# Altium schematic sheet usb.SchDoc: Micro USB Host/Device Port
size A4; SheetNumber: 12; SheetTotal: 18
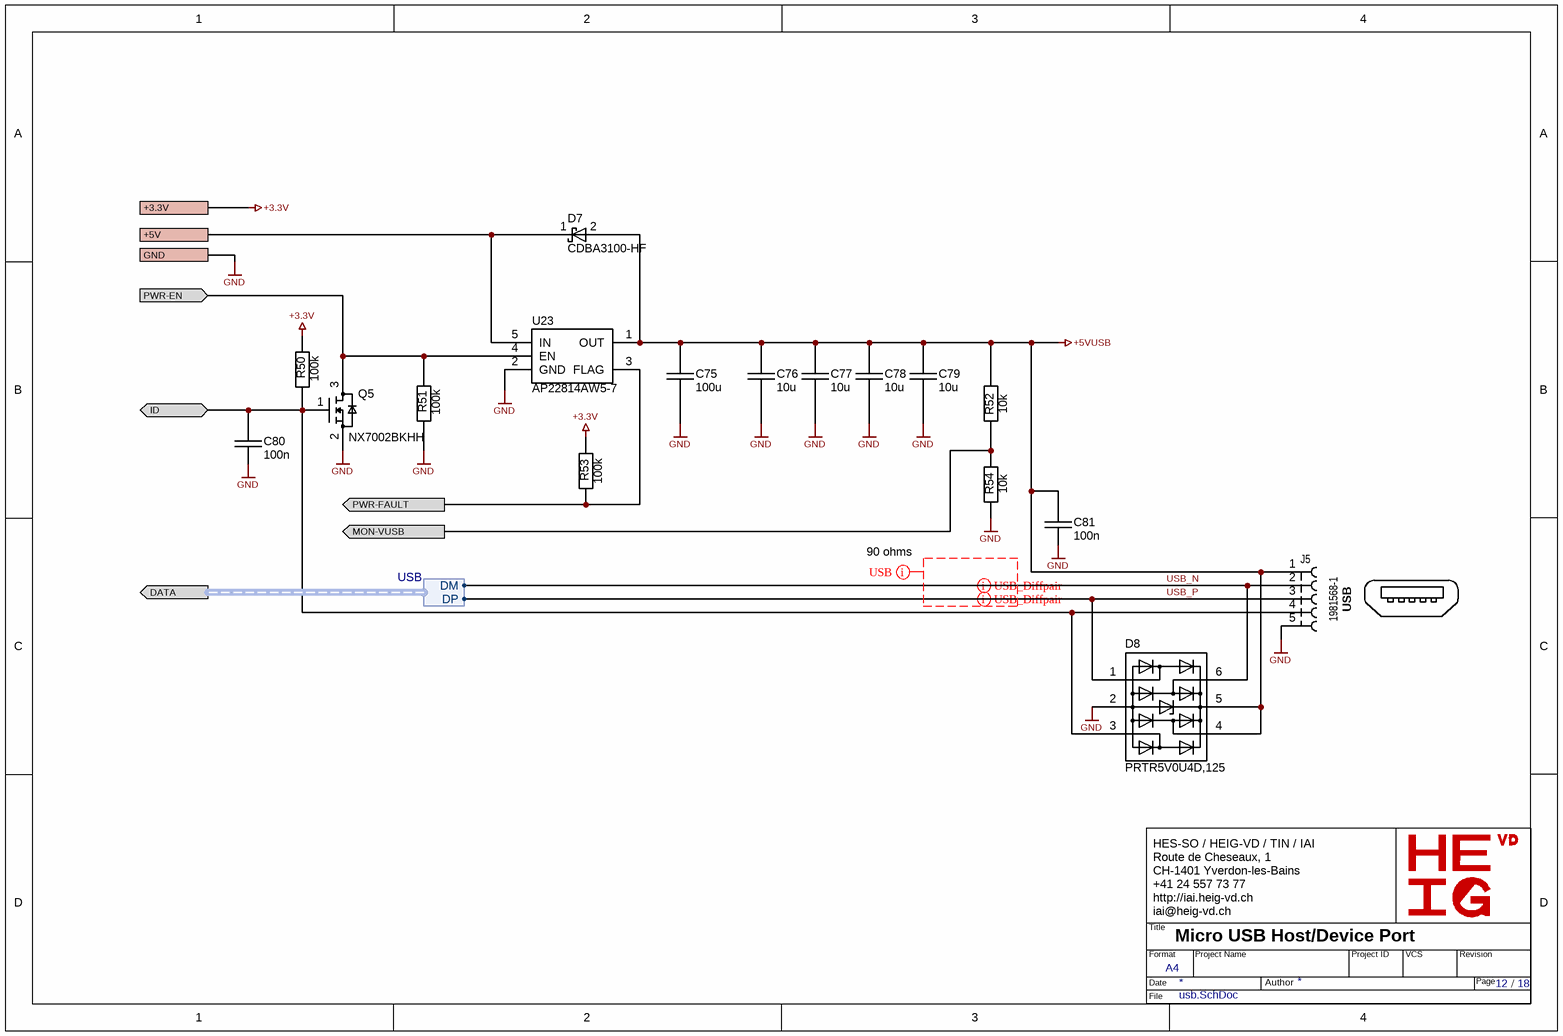
[diagram p0: usb.SchDoc]

## Parts
C75  100u  [SM/C1210]
C76  10u  [SM/C0603]
C77  10u  [SM/C0603]
C78  10u  [SM/C0603]
C79  10u  [SM/C0603]
C80  100n  [SM/C0402]
C81  100n  [SM/C0402]
D7  CDBA3100-HF  [DO214AC]
D8  PRTR5V0U4D,125  [SOT23-6]
J5  1981568-1  Function: USB  [TE/1981568-1/USB]
Q5  NX7002BKHH  [SOT8001/DFN0606-3]
R50  100k  [SM/R0805]
R51  100k  [SM/R0805]
R52  10k  [SM/R0402]
R53  100k  [SM/R0805]
R54  10k  [SM/R0402]
U23  AP22814AW5-7  [SOT23-5]

## Ports
+3.3V, +5V, DATA (out, harness USB), GND, ID (bidir), MON-VUSB (out), PWR-EN (in), PWR-FAULT (out)

## Harnesses
USB: DP, DM

## Nets
+3.3V: R50.2 R53.2 ; port +3.3V
+5VUSB: C75.1 C76.1 C77.1 C78.1 C79.1 C81.1 D7.2(A) D8.4(ESD3) D8.5(GND) J5.1 R52.2 U23.1(OUT)
GND: C75.2 C76.2 C77.2 C78.2 C79.2 C80.2 C81.2 D8.2(VCC) J5.5 Q5.2(VCC) R51.1 R54.1 U23.2(GND) ; port GND
+5V: D7.1(K) U23.5(IN) ; port +5V
ID: C80.1 D8.3(ESD2) J5.4 Q5.1(VCC) R50.1 ; port ID
MON-VUSB: R52.1 R54.2 ; port MON-VUSB
PWR-EN: Q5.3(VCC) R51.2 U23.4(EN) ; port PWR-EN
PWR-FAULT: R53.1 U23.3(FLAG) ; port PWR-FAULT
USB_N: D8.6(ESD4) J5.2 ; port DATA.DM
USB_P: D8.1(ESD1) J5.3 ; port DATA.DP

## Layout directives
differential pair: USB_N, USB_P
rule Impedance Constraint [Min = 85.00    Max = 95.00    ]; Impedance: 90 ohms; rule Differential Pairs Routing [Pref Gap = 6.43mil    Min Gap  = 5.906mil    Max Gap  = 6.43milPref Width = 9.048mil    Min Width  = 5.906mil    Max Width  = 9.048mil]; rule Matched Net Lengths [Tolerance = 10mil]; net class USB: (no net found under the mark)

## Notes on the sheet
- HES-SO / HEIG-VD / TIN / IAI
  Route de Cheseaux, 1
  CH-1401 Yverdon-les-Bains
  +41 24 557 73 77
  http://iai.heig-vd.ch
  iai@heig-vd.ch
- Title
- Format
- Date
- A4
- Project Name
- Author
- Project ID
- VCS
- Revision
- Page
- /
- File

## Library data of the parts
C75 = CAP CER 100UF 10V X5R 1210: 100 µF ±20% 10V Ceramic Capacitor X5R 1210 (3225 Metric); Supplier 1: Digi-Key; Supplier Part Number 1: 1276-3364-1-ND; Value: 100u; Voltage: 10V; Dielectric: X5R
C76-C79 = CAP CER 10UF 25V X5R 0603: 10 µF ±20% 25V Ceramic Capacitor X5R 0603 (1608 Metric); Dielectric: X7R; Supplier 1: Digi-Key; Supplier Part Number 1: 490-7202-1-ND; Voltage: 25V; Value: 10u
C80 C81 = CAP CER 100NF 25V X5R 0402: 100 nF ±10% 25V Ceramic Capacitor X5R 0402 (1005 Metric); Voltage: 25V; Dielectric: X5R; Supplier 1: Digi-Key; Supplier Part Number 1: 1276-1043-1-ND; Value: 100n
D7 = DIODE SCHOTTKY 100V 3A DO214AC: Diode 100 V 3A Surface Mount DO-214AC (SMA); Supplier 1: Digi-Key; Supplier Part Number 1: 641-1747-1-ND
D8 = PRTR5V0U4D: Ultra low capacitance quadruple rail-to-rail ESD protection, surface mount 6-TSOP; Mounting: SMD; Supplier 1: Digi-Key; Supplier Part Number 1: 1727-3890-1-ND; Supplier 2: Mouser; Supplier Part Number 2: 771-PRTR5V0U4D-T/R
J5 = CONN 5 Socket: USB - micro B USB 2.0 Receptacle Connector 5 Position Surface Mount, Right Angle; Supplier 1: Digi-Key; Supplier Part Number 1: A97800CT-ND
Q5 = 2N7002: N-Channel 60 V 350mA (Ta) 380mW (Ta), 2.8W (Tc) Surface Mount DFN0606-3; Value: 2N7002; Supplier 1: Digi-Key; Supplier Part Number 1: 1727-8574-1-ND
R50 R51 R53 = RES 100K OHM 1% 1/16W 0402: 100 kOhms ±1% 0.063W, 1/16W Chip Resistor 0402 (1005 Metric) Moisture Resistant Thick Film; Supplier 1: Digi-Key; Supplier Part Number 1: 13-RC0402FR-13100KLCT-ND; Value: 100k
R52 R54 = RES 10K OHM 1% 1/16W 0402: 10 kOhms ±1% 0.063W, 1/16W Chip Resistor 0402 (1005 Metric) Moisture Resistant Thick Film; Supplier 1: Digi-Key; Supplier Part Number 1: 1276-3431-1-ND; Value: 10k
U23 = AP22804: Power Switch/Driver 1:1 P-Channel 3A SOT-25; Supplier 1: Digi-Key; Supplier Part Number 1: AP22814AW5-7DICT-ND